# EasyEDA Pro project ProPrj_cdweather_2025-08-09.epro

# Schematic Schematic1
Board Name: Board1; Create Date: 2025-07-23; Page Name: P1; Project Name: cdweather; Schematic Name: Schematic1; Update Date: 2025-07-23; Company: EasyEDA.com; Page Size: A4; Version: V1.0
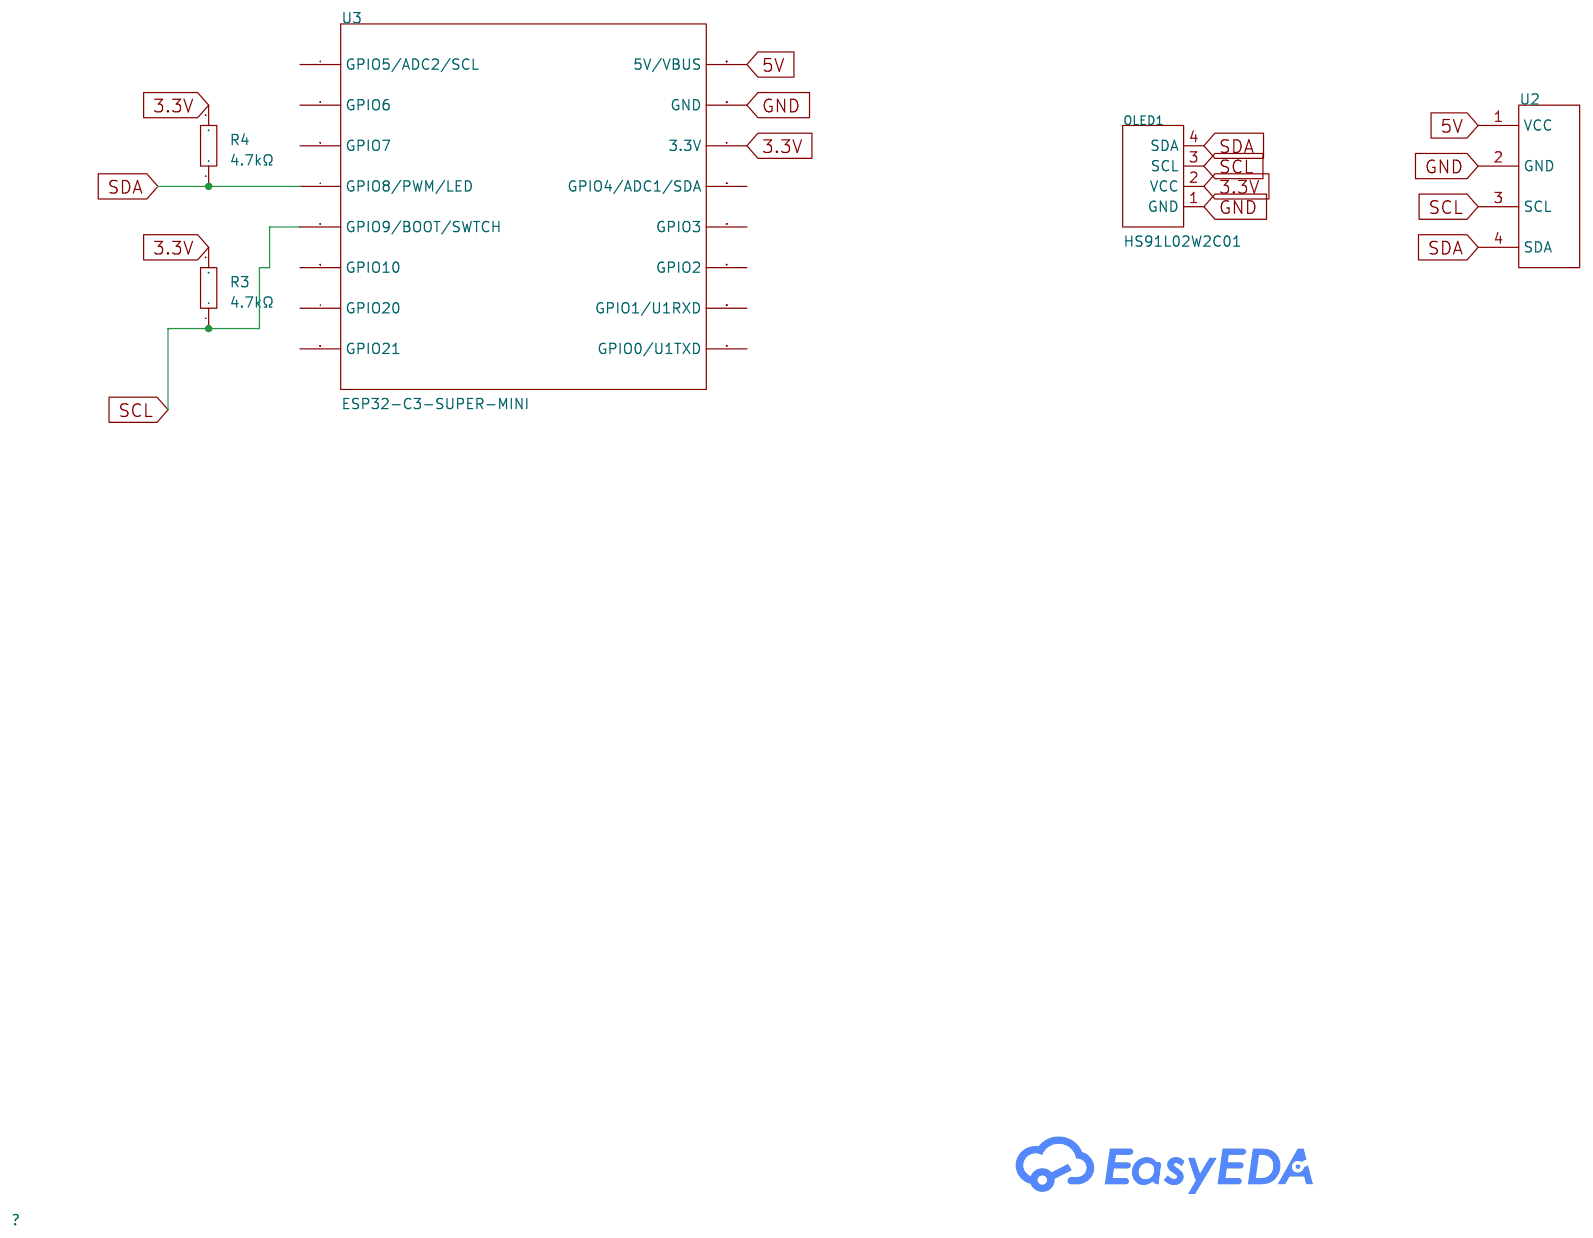
[diagram p0: schematic sheet]

## Parts
OLED1  HS91L02W2C01  [OLED-TH_L38.0-W12.0_HS91L02W2C01]
R3  4.7kΩ  [RES-TH_BD2.3-L6.5-P10.50-D0.5]
R4  4.7kΩ  [RES-TH_BD2.3-L6.5-P10.50-D0.5]
U2  -  [BME280 Module]
U3  ESP32-C3-SUPER-MINI  [ESP32-C3-SUPER-MINI]

## Library data of the parts
OLED1 = HS91L02W2C01: Main Control Chip:SSD1306 Interface Type:I2C Size:0.91 Pixel Resolution:128x32 Operating Temperature:-40℃~+70℃ Operating Temperature:-40℃~+70℃; LCSC Part Name: 0.91寸OLED显示屏白光IIC; Supplier Part: C5248081; Manufacturer: HS(汉昇); JLCPCB Part Class: Extended Part; Datasheet: https://atta.szlcsc.com/upload/public/pdf/source/20230727/C3E43C8E3DDA847F5681FEE7D95C153D.pdf; Supplier: LCSC; Main Control Chip: SSD1306; Interface Type: I2C; Size: 0.91; Pixel Resolution: 128x32; Operating Temperature: -40℃~+70℃
R3 R4 = CF1/4W-4.7KΩ±5% T: Type:Carbon Resister Resistance: Tolerance:±5% Tolerance:±5% Voltage-Supply(Max):250V Power(Watts):250mW Temperature Coefficient:±350ppm/℃ Temperature Coefficient:±350ppm/℃ Operating Temperature:-55℃~+155℃ Operating Temperature:-55℃~+155℃; LCSC Part Name: 4.7kΩ ±5% 250mW 碳膜电阻 圆柱状直插; Supplier Part: C120071; Manufacturer: CCO(千志电子); Supplier Footprint: 插件,D2.3xL6.5mm; JLCPCB Part Class: Extended Part; Datasheet: https://atta.szlcsc.com/upload/public/pdf/source/20190910/C427328_A0A2D65F3FD547937F4E674C90868175.pdf; Supplier: LCSC; Type: Carbon Resister; Tolerance: ±5%; Voltage-Supply(Max): 250V; Power(Watts): 250mW; Temperature Coefficient: ±350ppm/℃; Operating Temperature: -55℃~+155℃
U2 = BME280 Module - V
U3 = ESP32-C3-SUPER-MINI: Manufacturer: Maker go; link: https://www.tindie.com/products/adz1122/esp32-c3-development-board-esp32-supermini/

## Nets
3.3V: OLED1.2(VCC) R3.2 R4.2 U3.14(3.3V)
5V: U2.1(VCC) U3.16(5V/VBUS)
GND: OLED1.1(GND) U2.2(GND) U3.15(GND)
SCL: OLED1.3(SCL) R3.1 U2.3(SCL) U3.5(GPIO9/BOOT/SWTCH)
SDA: OLED1.4(SDA) R4.1 U2.4(SDA) U3.4(GPIO8/PWM/LED)

Not connected (* = marked no-connect by the designer): U3 1(GPIO5/ADC2/SCL) 2(GPIO6) 3(GPIO7) 6(GPIO10) 7(GPIO20) 8(GPIO21) 9(GPIO0/U1TXD) 10(GPIO1/U1RXD) 11(GPIO2) 12(GPIO3) 13(GPIO4/ADC1/SDA)

# Board PCB2
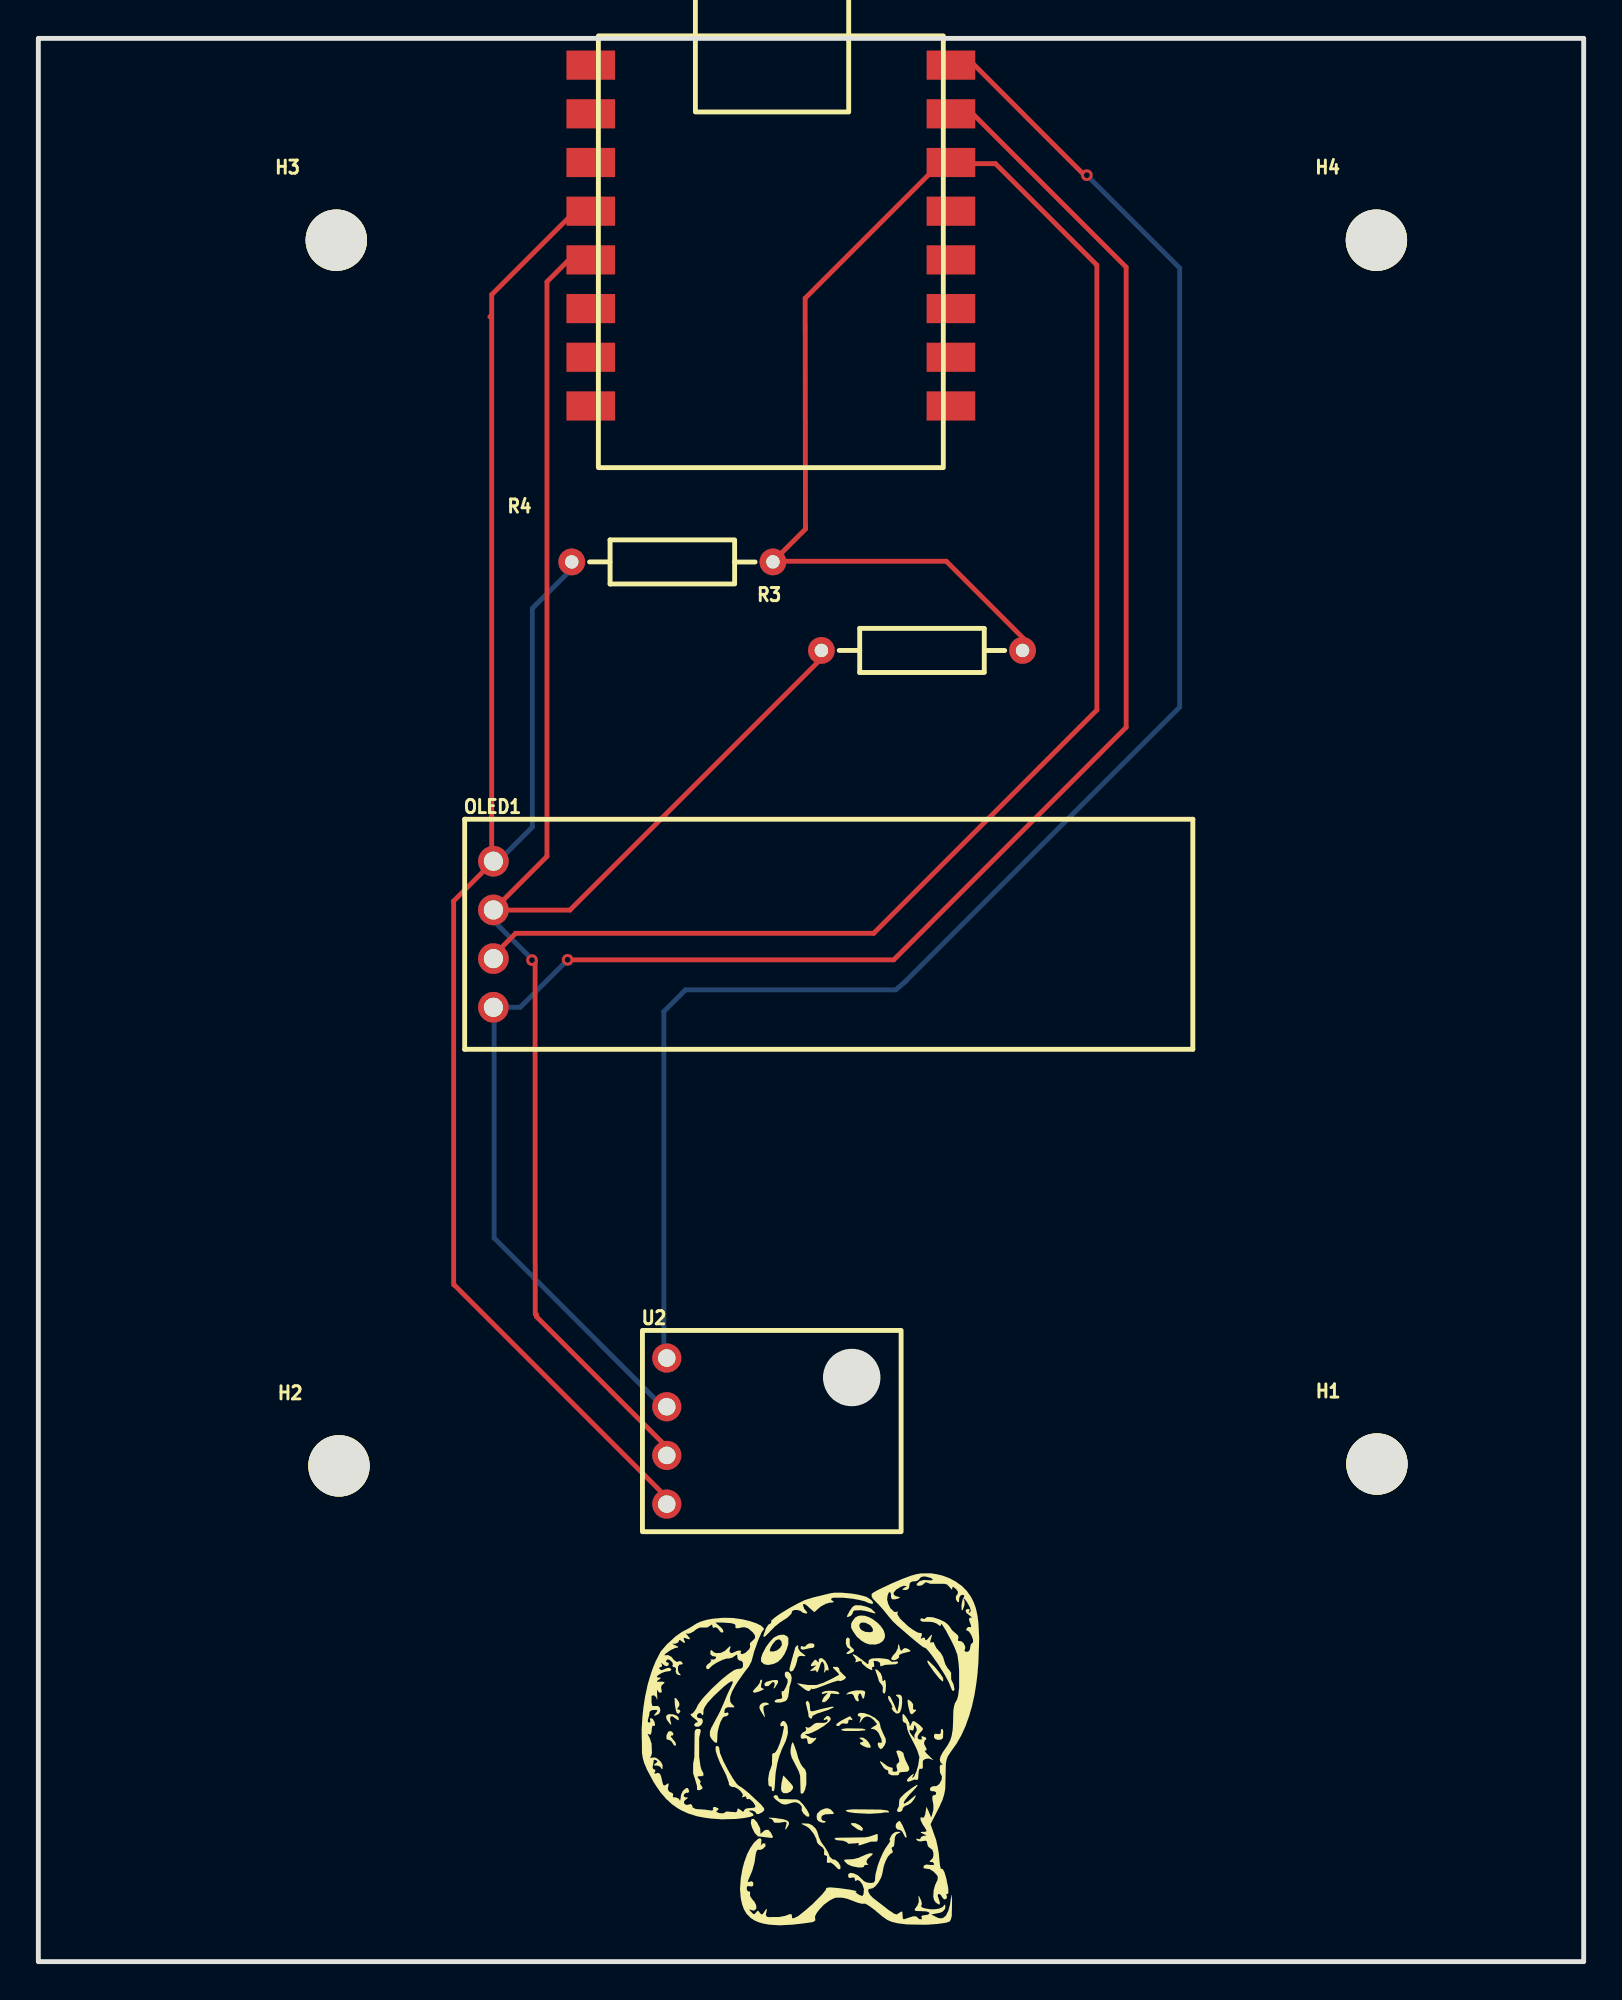
[diagram p1: board, top side]
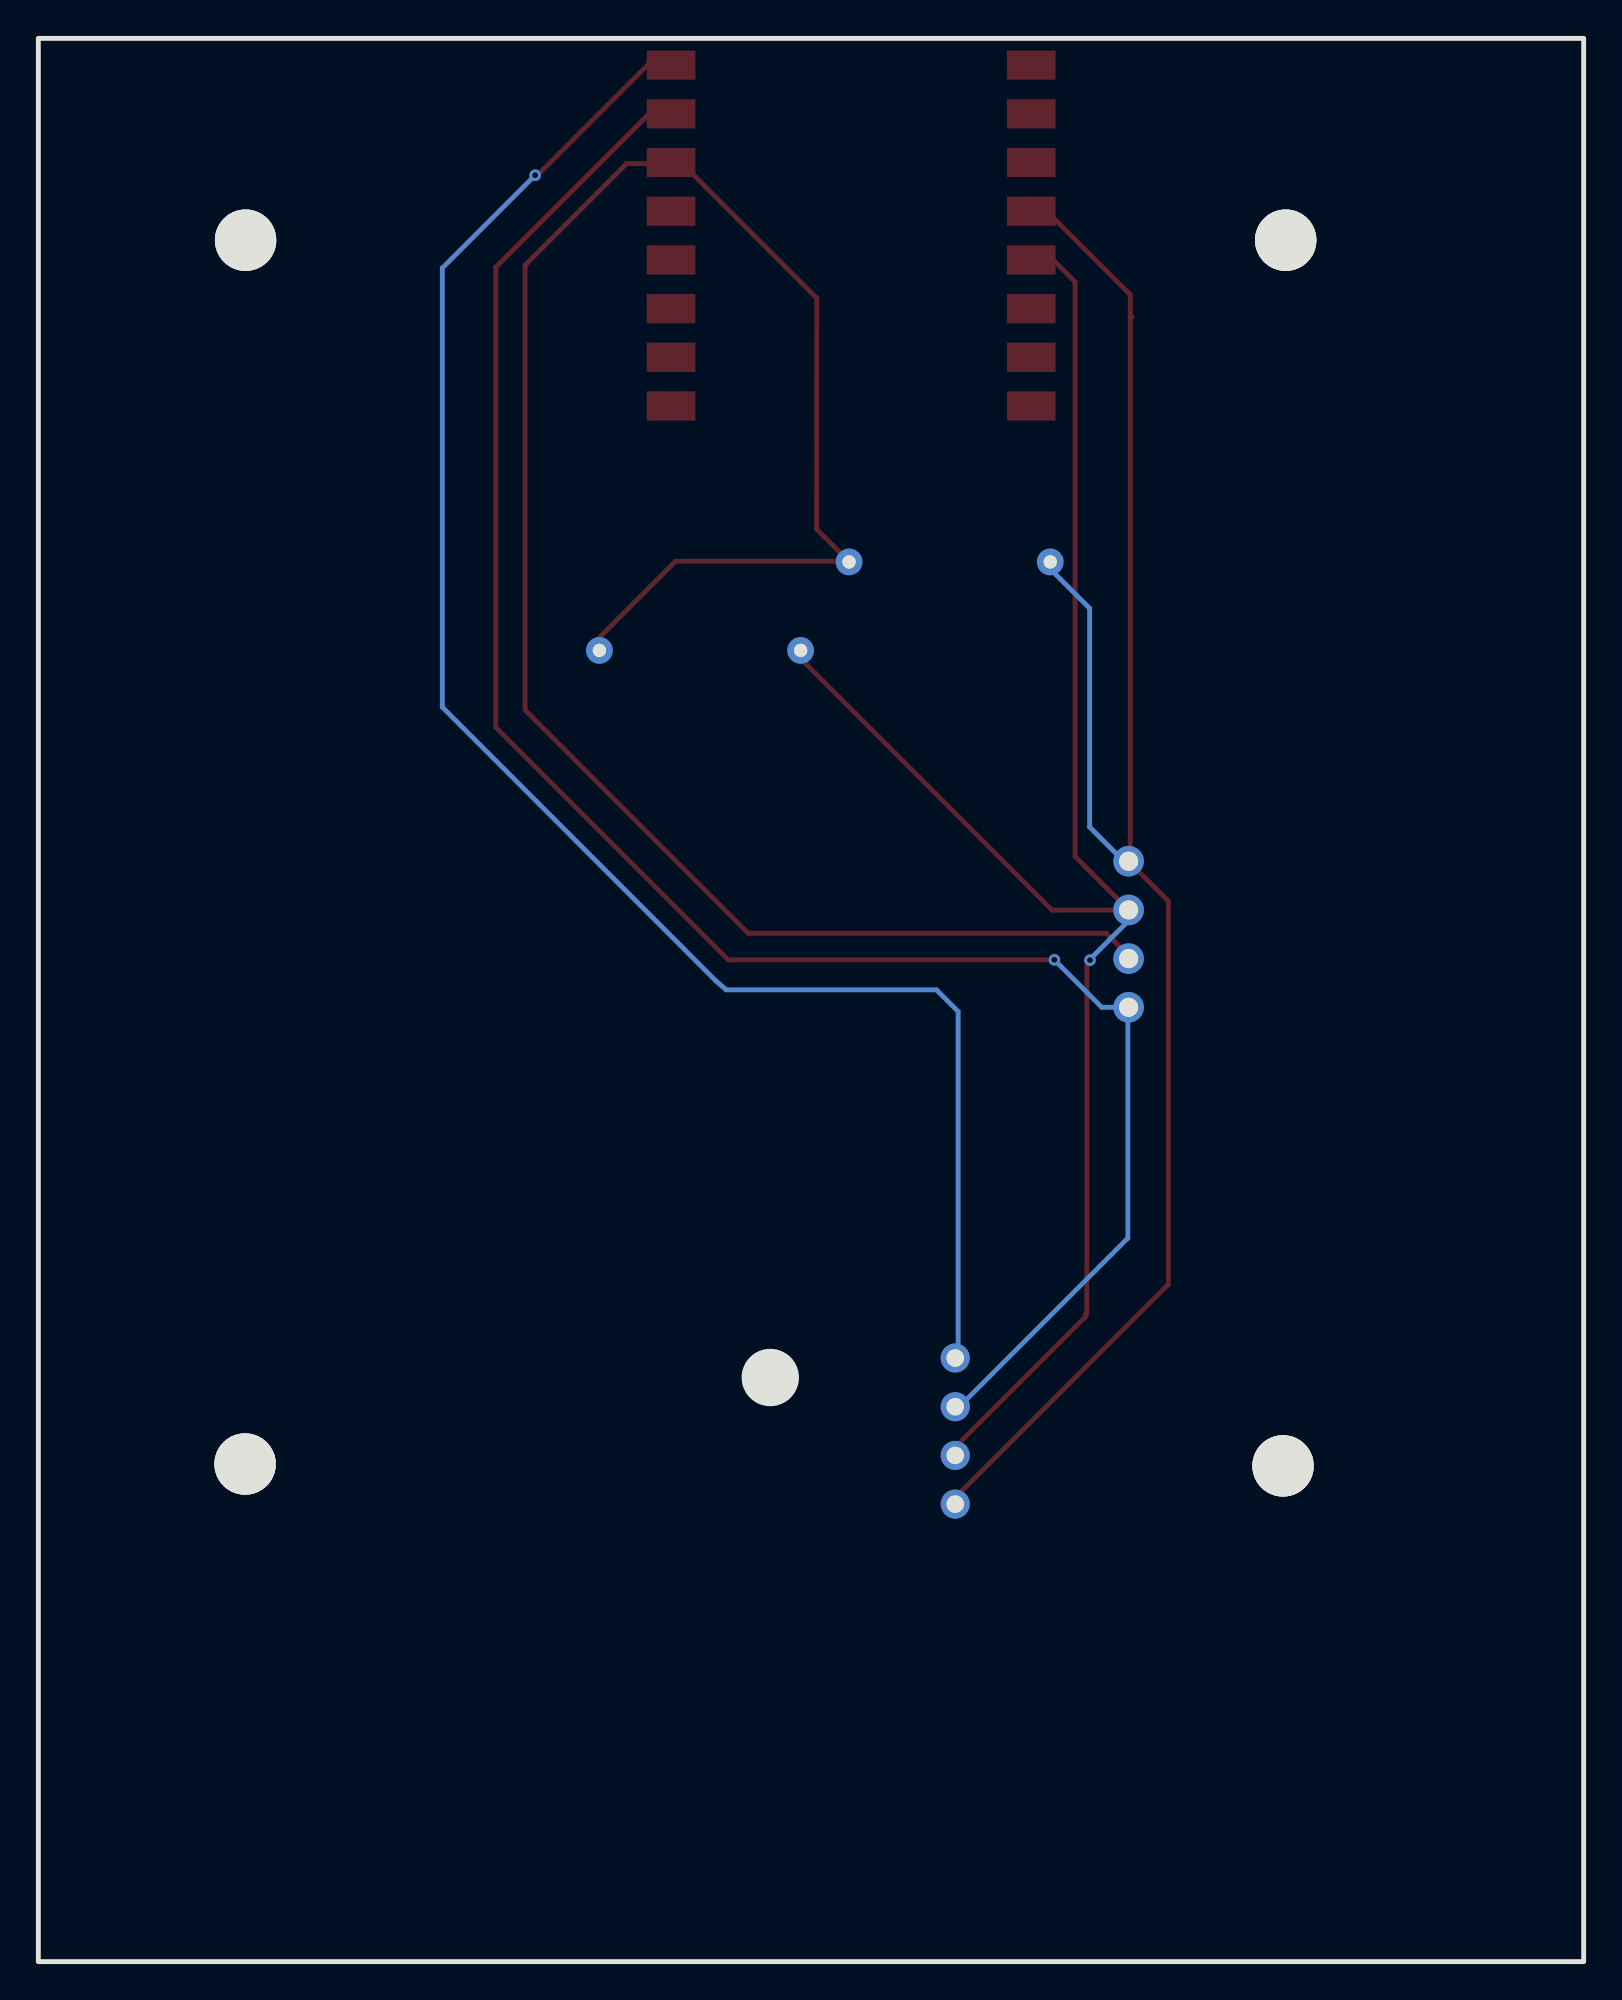
[diagram p2: board, bottom side, seen from below]

Outline 80.65 x 100.33 mm; copper layers: Top Layer, Bottom Layer. Coordinates in mm from the lower left corner of the outline.
Outline path: rectangle 0,100.33 80.65,0
Stack: Top Layer 0.035mm / Dielectric1 1.51mm FR4 er 4.5 / Bottom Layer 0.035mm

## Design rules (mm)
template: JLCPCB Capability(Two Layers Board)
spacing copperThickness1oz (default): track to track 0.102, other pairs 0.152 to 0.3
spacing copperThickness2oz: track to track 0.203, other pairs 0.152 to 0.3
track width copperThickness1oz (default): min 0.127, default 0.254, max 2.54
track width copperThickness2oz: min 0.203, default 0.254, max 2.54
differential pair differentialPair (default): width min 0.127, default 0.254, max 2.54; gap min 0.152, default 0.152
via viaSize (default): diameter min 0.5, default 0.61, max 10; hole min 0.3, default 0.305, max 6.3

## Placement (name value [footprint] x y rotation side)
H1  -  [0_User_Library:MountingHole_3.2mm_M3]  69.86 25.96 0 top
H2  -  [0_User_Library:MountingHole_3.2mm_M3]  15.69 25.86 0 top
H3  -  [0_User_Library:MountingHole_3.2mm_M3]  15.55 89.8 0 top
H4  -  [0_User_Library:MountingHole_3.2mm_M3]  69.83 89.8 0 top
OLED1  HS91L02W2C01  [OLED-TH_L38.0-W12.0_HS91L02W2C01]  23.75 53.59 0 top
R3  4.7kΩ  [RES-TH_BD2.3-L6.5-P10.50-D0.5]  46.11 68.4 0 top
R4  4.7kΩ  [RES-TH_BD2.3-L6.5-P10.50-D0.5]  33.09 73.02 0 top
U2  -  [BME280 Module]  31.53 27.68 0 top
U3  -  [ESP32-C3-SUPER-MINI]  38.23 90.81 0 top

## Footprints (pads in the part's own frame, mm; a bottom-side part is the same pattern mirrored in y, then rotated)
0_User_Library:MountingHole_3.2mm_M3
  round 3.2 hole 3.2: 1(0,0)
BME280 Module
  round 1.524 hole 0.914: 1(1.27,3.81) 2(1.27,1.27) 3(1.27,-1.27) 4(1.27,-3.81)
ESP32-C3-SUPER-MINI
  rect 2.54x1.524 smd: 1(-9.398,8.128) 2(-9.398,5.588) 3(-9.398,3.048) 4(-9.398,0.508) 5(-9.398,-2.032) 6(-9.398,-4.572) 7(-9.398,-7.112) 8(-9.398,-9.652) 9(9.398,-9.652) 10(9.398,-7.112) 11(9.398,-4.572) 12(9.398,-2.032) 13(9.398,0.508) 14(9.398,3.048) 15(9.398,5.588) 16(9.398,8.128)
OLED-TH_L38.0-W12.0_HS91L02W2C01
  round 1.6 hole 1: 1(0,-3.81) 2(0,-1.27) 3(0,1.27) 4(0,3.81)
RES-TH_BD2.3-L6.5-P10.50-D0.5
  round 1.4 hole 0.7: 1(-5.25,0) 2(5.25,0)

## Nets
As in the schematic.

Pads without a net: H1 1; H2 1; H3 1; H4 1; U3 1 2 3 6 7 8 9 10 11 12 13

## Via types
v1: diameter 0.61, hole 0.305, Top Layer to Bottom Layer, 3 vias

## Routing (per net, layer and track width the routed paths; a pad name or vN(x,y) marks a point on that pad's centre or on a via; arc(x,y) is an arc through that point)
3.3V: length 107.9
  Top Layer w0.254: 48.12,93.79 49.95,93.79 55.24,88.5 55.24,65.29 43.59,53.64 24.91,53.64 23.85,52.58 ; 51.57,68.86 47.38,73.05 38.86,73.05 ; 38.32,73.02 40.03,74.73 40.02,86.77 46.95,93.71
5V: length 90.6
  Top Layer w0.254: 47.92,99.09 48.69,99.09 54.66,93.12
  Bottom Layer w0.254: 45.23,51.11 45.3,51.18 ; 45.3,51.18 59.56,65.44 59.56,88.35 v1(54.72,93.19) ; 45.3,51.18 44.75,50.7 33.77,50.7 32.64,49.56 ; 32.64,31.52 32.64,49.56
GND: length 100.4
  Top Layer w0.254: v1(27.62,52.26) 44.64,52.26 56.77,64.39 56.77,88.39 48.77,96.39 U3.15
  Bottom Layer w0.254: 23.78,49.78 23.78,37.75 32.71,28.82 ; 23.78,49.78 25.15,49.78 v1(27.62,52.26) ; 23.78,49.78 23.78,50.01
SCL: length 91.4
  Top Layer w0.254: 25.93,36.48 25.93,52.17 25.83,52.27 ; 33.07,26.58 26,33.64 26,33.77 ; OLED1.3 26.54,57.66 26.54,87.63 27.69,88.77 U3.5 ; 25.93,33.77 25.93,36.39 ; 41.17,68.29 27.74,54.85 24.13,54.85
  Bottom Layer w0.254: 23.84,54.98 23.84,54.21 25.81,52.25
  vias: v1(25.76,52.25)
SDA: length 91.4
  Top Layer w0.254: 32.55,24.46 21.7,35.31 ; OLED1.4 21.67,55.33 21.67,35.31 ; 28.38,91.68 23.66,86.96 23.66,85.9 23.56,85.8 ; 23.66,58.07 23.66,85.8
  Bottom Layer w0.254: 28.09,72.91 25.78,70.6 25.78,59.19 24.19,57.6 23.62,57.6
